# Altium schematic sheet ZigBee.SchDoc: ZigBee底板电路图
size A3
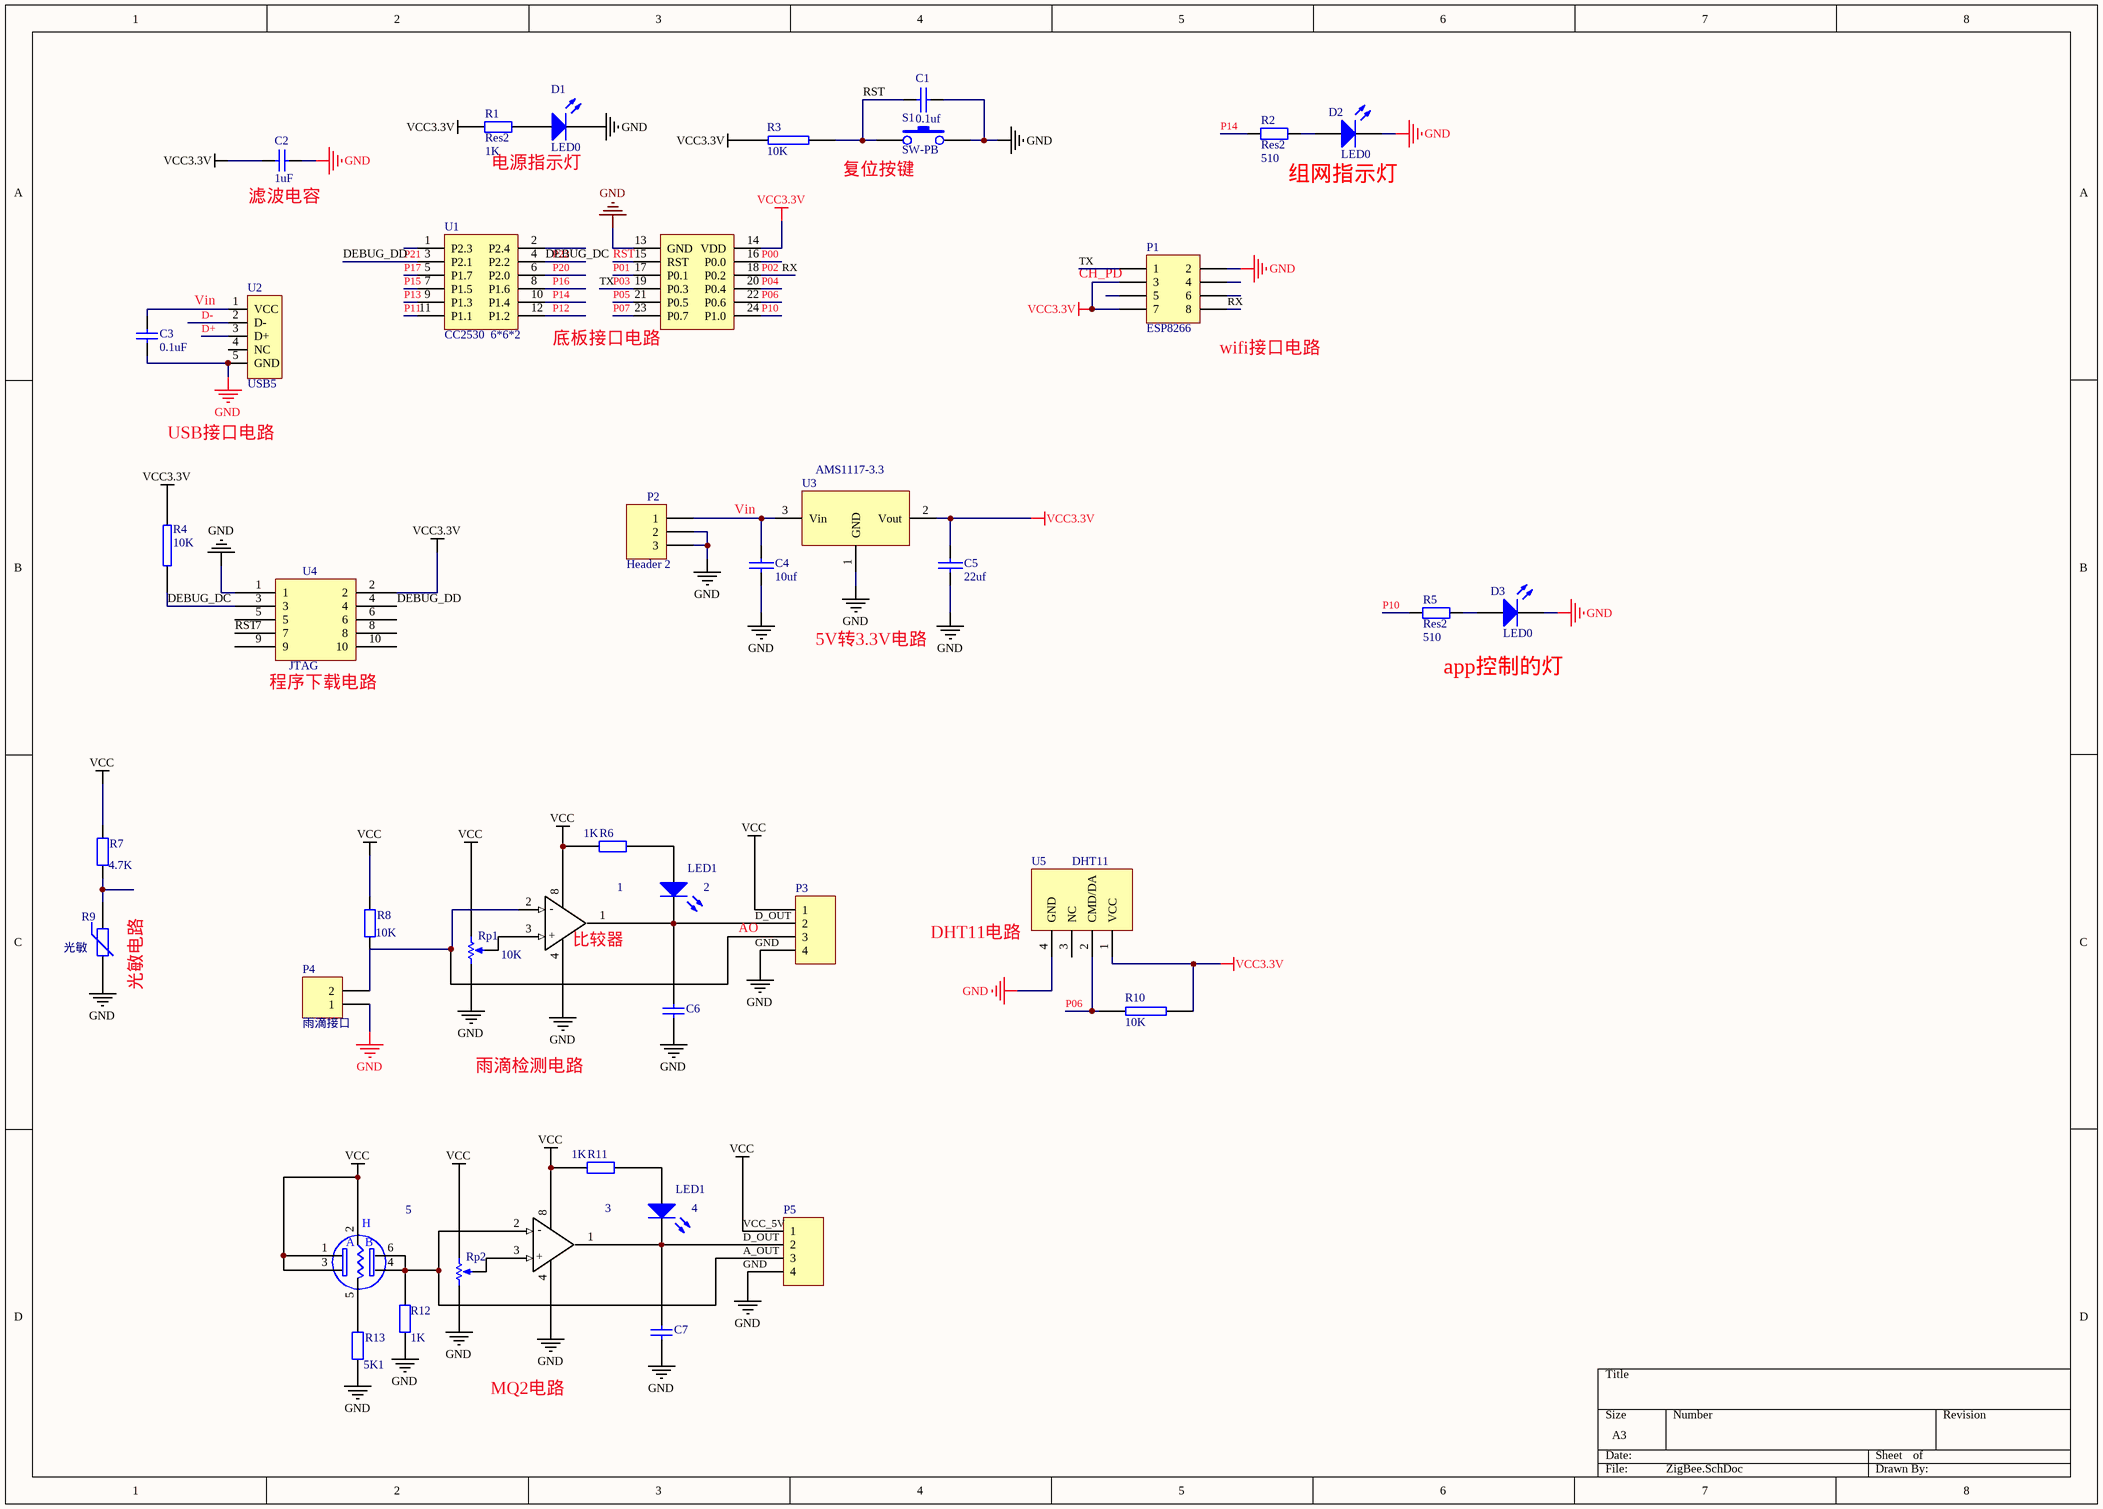
[diagram p0: ZigBee.SchDoc]

## Parts
1  (no value)
2  LED1  [LED-1]
3  (no value)
4  LED1  [LED-1]
5  (no value)
C1  0.1uf  [0805C]
C2  value 1uF  [0805C]
C3  value 0.1uF  [0805C]
C4  10uf  [0805C]
C5  22uf  [0805C]
C6  (no value)  [CAPC3216L]
C7  (no value)  [CAPC3216L]
D1  LED0  [0805D]
D2  LED0  [0805D]
D3  LED0  [0805D]
P1  ESP8266  [HDR2X4]
P2  Header 2  [DC-SEAT]
P3  (no value)  [HDR1X4]
P4  雨滴接口  [HDR1X2]
P5  (no value)  [HDR1X4]
R1  Res2  value 1K  [0805R]
R2  Res2  value 510  [0805R]
R3  10K  [0805R]
R4  10K  [0805R]
R5  Res2  value 510  [0805R]
R6  value 1K  [AXIAL-0.4]
R7  value 4.7K  [AXIAL-0.4]
R8  value 10K  [AXIAL-0.4]
R9  光敏  [RESC2012N]
R10  10K  [0805R]
R11  value 1K  [AXIAL-0.4]
R12  value 1K  [AXIAL-0.4]
R13  value 5K1  [AXIAL-0.4]
Rp1  value 10K  [VR5]
Rp2  (no value)  [VR5]
S1  SW-PB  [四脚按键]
U1  CC2530  6*6*2  [CC2530  6*6*2]
U2  USB5  [USB5]
U3  AMS1117-3.3  [SOT-223]
U4  JTAG  [JTAG]
U5  DHT11

## Nets
GND: 1.4 3.4 C1.1 C2.1 C3.2 C4.2 C5.2 C6.2 C7.2 D1.K D2.K D3.K P1.2 P2.2 P2.3 P3.4 P4.1 P5.4 R12.1 R13.1 Rp1.1(TOP) Rp2.1(TOP) S1.2 U1.13(GND) U2.5(GND) U3.1(GND) U4.1 U5.4(GND)
VCC3.3V: C2.2 C5.1 P1.3 P1.7 R1.1 R3.2 R4.2 R10.1 U1.14(VDD) U3.2(Vout) U4.2 U5.1(VCC)
VCC_5V: 1.8 3.8 5.1 5.2 5.3 P3.1 P5.1 R6.2 R7.2 R8.2 R11.2 Rp1.2(BOT) Rp2.2(BOT)  [also labelled VCC]
A_OUT: 3.2 5.4 5.6 P5.3 R12.2
AO: 1.2 P3.3
D+: U2.3(D+)
D-: U2.2(D-)
D_OUT: 1.1 2.2(K) 3.1 4.2(K) C6.1 C7.1 P3.2 P5.2
DEBUG_DC: R4.1 U1.4(P2.2) U4.3  [also labelled P22]
DEBUG_DD: U1.3(P2.1) U4.4  [also labelled P21]
P00: U1.16(P0.0)
P01: U1.17(P0.1)
P02: P1.8 U1.18(P0.2)  [also labelled RX]
P03: P1.1 U1.19(P0.3)  [also labelled TX]
P04: U1.20(P0.4)
P05: U1.21(P0.5)
P06: R10.2 U1.22(P0.6) U5.2(CMD/DA)
P07: U1.23(P0.7)
P10: R5.1 U1.24(P1.0)
P11: U1.11(P1.1)
P12: U1.12(P1.2)
P13: U1.9(P1.3)
P14: R2.1 U1.10(P1.4)
P15: U1.7(P1.5)
P16: U1.8(P1.6)
P17: U1.5(P1.7)
P20: U1.6(P2.0)
RST: C1.2 R3.1 S1.1 U1.15(RST) U4.7
Vin: C3.1 C4.1 P2.1 U2.1(VCC) U3.3(Vin)
Net1_3: 1.3 Rp1.3(TAP)
Net2_1: 2.1(A) R6.1
Net3_3: 3.3 Rp2.3(TAP)
Net4_1: 4.1(A) R11.1
Net5_5: 5.5 R13.2
NetD1_A: D1.A R1.2
NetD2_A: D2.A R2.2
NetD3_A: D3.A R5.2
NetP4_2: P4.2 R8.1
NetR7_1: R7.1 R9.1

Not connected (* = marked no-connect by the designer): P1 4 5 6; R9 2; U1 1(P2.3) 2(P2.4); U2 4(NC); U4 5 6 8 9 10; U5 3(NC)

## Notes on the sheet
- 电源指示灯
- 复位按键
- 组网指示灯
- (near C2) 滤波电容
- (near U1) 底板接口电路
- (near P1) wifi接口电路
- USB接口电路
- 5V转3.3V电路
- (near U4) 程序下载电路
- app控制的灯
- (near R9) 光敏电路
- (near 1) 比较器
- DHT11电路
- 雨滴检测电路
- MQ2电路
- Labels drawn without touching a wire or pin: CH_PD, GND
- (in symbol bijiaoqi) -; +
- (in symbol MQ-2) H; A; B

## Library data of the parts
1 3 = bijiaoqi
2 4 = LED1: Typical RED GaAs LED; Published: 8-Jun-2000; LatestRevisionDate: 08-Jul-2005; LatestRevisionNote: Mech Layer 1 removed.; PackageReference: LED-1; Publisher: Altium Limited
5 = MQ-2
C1 C4 C5 = CAP: Capacitor
C2 C3 = Cap: Capacitor; Published: 8-Jun-2000; LatestRevisionDate: 17-Jul-2002; LatestRevisionNote: Re-released for DXP Platform.; PackageReference: RAD-0.3; Publisher: Altium Limited
C6 C7 = Cap Semi: Capacitor (Semiconductor SIM Model); Published: 8-Jun-2000; LatestRevisionDate: 29-May-2009; LatestRevisionNote: IPC-7351 Footprint Added.; PackageReference: C1206; Publisher: Altium Limited; PackageDescription: Chip Capacitor
D1-D3 = LED0: Typical INFRARED GaAs LED; Published: 8-Jun-2000; LatestRevisionDate: 08-Jul-2005; LatestRevisionNote: Mech Layer 1 removed.; PackageReference: LED-0; Publisher: Altium Limited
P1 = Header 4X2: Header, 4-Pin, Dual row; LatestRevisionDate: 17-Jul-2002; LatestRevisionNote: Re-released for DXP Platform.; Publisher: Altium Limited
P2 = Header 3: Header, 3-Pin; LatestRevisionDate: 17-Jul-2002; LatestRevisionNote: Re-released for DXP Platform.; Publisher: Altium Limited
P3 P5 = Header 4: Header, 4-Pin; LatestRevisionDate: 17-Jul-2002; LatestRevisionNote: Re-released for DXP Platform.; Publisher: Altium Limited
P4 = Header 2: Header, 2-Pin; LatestRevisionDate: 17-Jul-2002; LatestRevisionNote: Re-released for DXP Platform.; Publisher: Altium Limited
R1 R2 R5-R8 R11-R13 = Res2: Resistor; Published: 8-Jun-2000; LatestRevisionDate: 17-Jul-2002; LatestRevisionNote: Re-released for DXP Platform.; PackageReference: AXIAL-0.4; Publisher: Altium Limited
R3 R4 R10 = RES2
R9 = Res Varistor: Varistor (Voltage-Sensitive Resistor); Published: 24-Mar-1999; LatestRevisionDate: 29-May-2009; LatestRevisionNote: IPC-7351 Footprint Added.; PackageVersion: Mar-2003; PackageReference: 6-0805; Publisher: Altium Limited; PackageDescription: Chip Resistor 0805 Case Size; Code_IPC: RESC2012
Rp1 Rp2 = RPot: Potentiometer; Sim Note: Enter the Resistance value and the set point into parameter fields.; Set Position: 0.5; Published: 8-Jun-2000; LatestRevisionDate: 17-Jul-2002; LatestRevisionNote: Re-released for DXP Platform.; PackageReference: VR5; Publisher: Altium Limited
U3 = AMS1117